# Altium schematic sheet HC-SR04.SchDoc
size A4
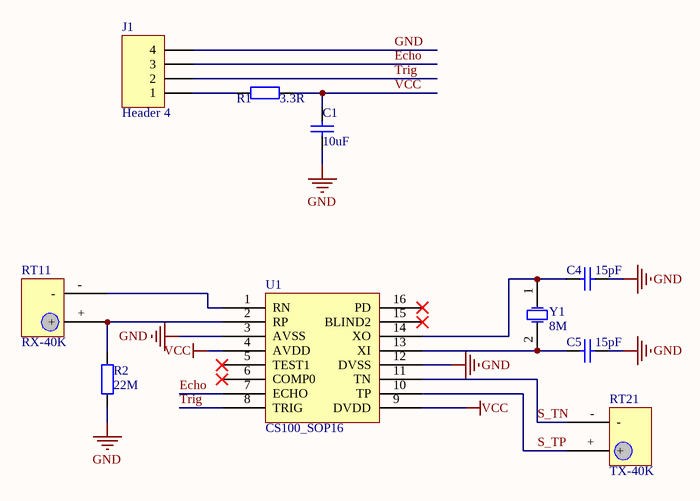
[diagram p0: HC-SR04.SchDoc]

## Parts
C1  value 10uF  [2012[0805]]  (hidden comment: Cap)
C4  value 15pF  [1608[0603]]  (hidden comment: Cap)
C5  value 15pF  [1608[0603]]  (hidden comment: Cap)
J1  Header 4  [DIP4-2PCB]
R1  value 3.3R  [1608[0603]]  (hidden comment: Res2)
R2  value 22M  [1608[0603]]  (hidden comment: Res2)
RT11  RX-40K  [US-16mm]
RT21  TX-40K  [US-16mm]
U1  CS100_SOP16  [SOIC16]
Y1  8M  [XTAL]

## Nets
GND: C1.1 C4.2 C5.2 J1.4 R2.1 U1.3(AVSS) U1.12(DVSS)
VCC: C1.2 R1.2 U1.4(AVDD) U1.9(DVDD)
Echo: J1.3 U1.7(ECHO)
S_TN: RT21.- U1.11(TN)
S_TP: RT21.+ U1.10(TP)
Trig: J1.2 U1.8(TRIG)
NetC4_1: C4.1 U1.14(XO) Y1.1(OSC1)
NetC5_1: C5.1 U1.13(XI) Y1.2(OSC2)
NetJ1_1: J1.1 R1.1
NetR2_2: R2.2 RT11.+ U1.2(RP)
NetRT11_-: RT11.- U1.1(RN)

Not connected (* = marked no-connect by the designer): U1 5(TEST1)* 6(COMP0)* 15(BLIND2)* 16(PD)*

## Library data of the parts
C1 C4 C5 = Cap: Capacitor; Published: 8-Jun-2000; LatestRevisionDate: 17-Jul-2002; LatestRevisionNote: Re-released for DXP Platform.; PackageReference: RAD-0.3; Publisher: Altium Limited
J1 = Header 4: Header, 4-Pin; LatestRevisionDate: 17-Jul-2002; LatestRevisionNote: Re-released for DXP Platform.; Publisher: Altium Limited
R1 R2 = Res2: Resistor; Published: 8-Jun-2000; LatestRevisionDate: 17-Jul-2002; LatestRevisionNote: Re-released for DXP Platform.; PackageReference: AXIAL-0.4; Publisher: Altium Limited
RT11 RT21 = TC40K
Y1 = XTAL: Crystal Oscillator; Published: 8-Jun-2000; LatestRevisionDate: 17-Jul-2002; LatestRevisionNote: Re-released for DXP Platform.; PackageReference: R38; Publisher: Altium Limited